# EAGLE design open-bldc-power (EAGLE 6.2)
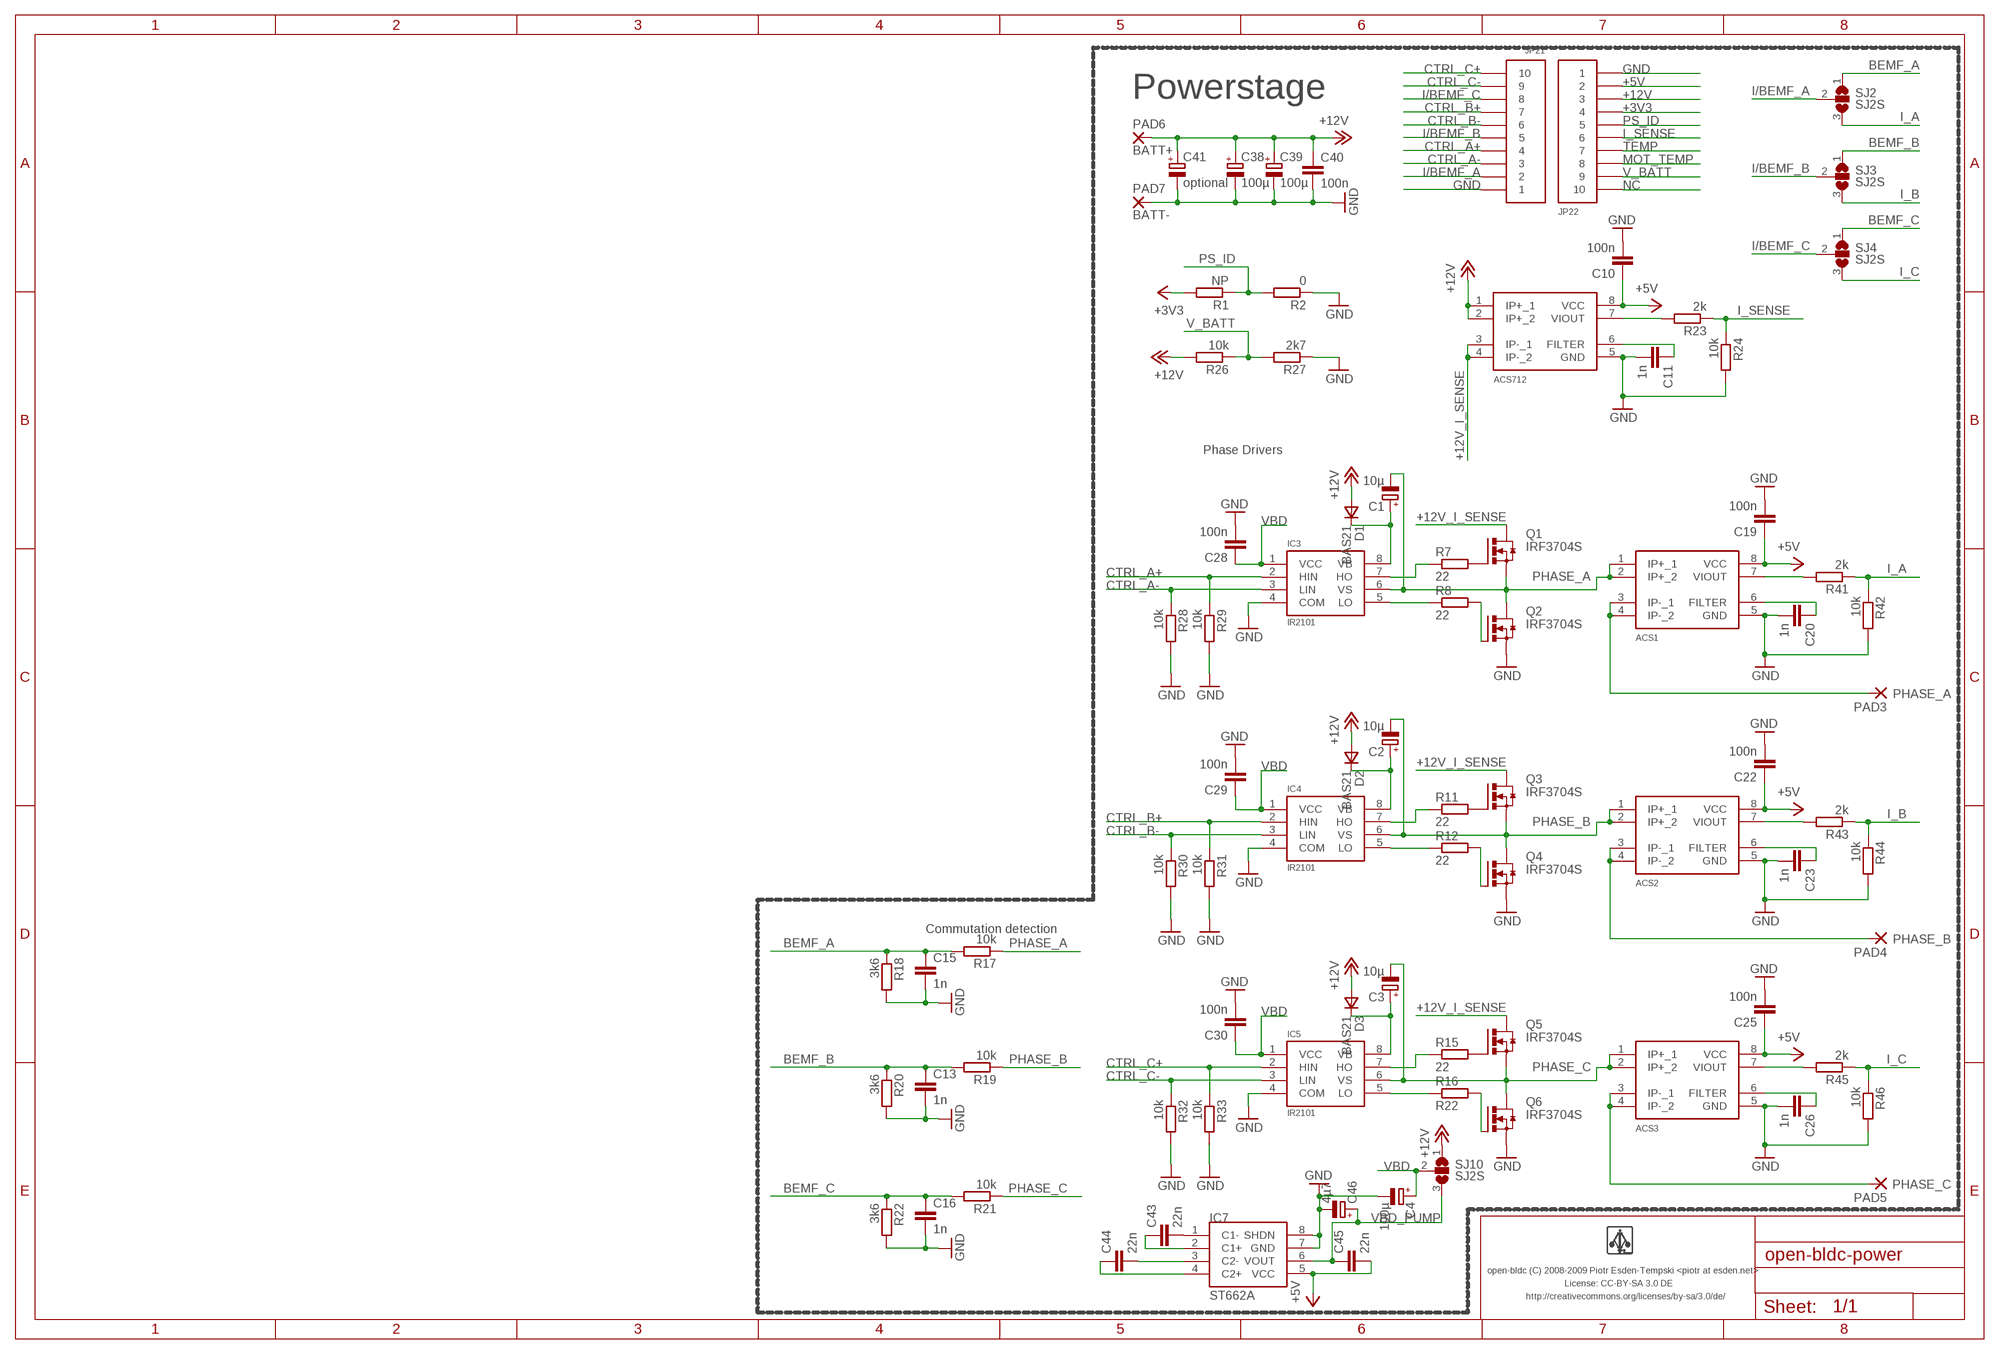
[diagram p0: schematic, sheet 1]

## Parts
ACS1  ACS712  [SO8]
ACS2  ACS712  [SO8]
ACS3  ACS712  [SO8]
ACS712  ACS712  [SO8]
C1  10µ  CPOL-EUA/3216-18R  [A/3216-18R]
C2  10µ  CPOL-EUA/3216-18R  [A/3216-18R]
C3  10µ  CPOL-EUA/3216-18R  [A/3216-18R]
C4  100µ  CPOL-EUD/7343-31R  [D/7343-31R]
C10  100n  C-EUC0603  [C0603]
C11  1n  C-EUC0603  [C0603]
C13  1n  C-EUC0603  [C0603]
C15  1n  C-EUC0603  [C0603]
C16  1n  C-EUC0603  [C0603]
C19  100n  C-EUC0603  [C0603]
C20  1n  C-EUC0603  [C0603]
C22  100n  C-EUC0603  [C0603]
C23  1n  C-EUC0603  [C0603]
C25  100n  C-EUC0603  [C0603]
C26  1n  C-EUC0603  [C0603]
C28  100n  C-EUC0603  [C0603]
C29  100n  C-EUC0603  [C0603]
C30  100n  C-EUC0603  [C0603]
C38  100µ  CPOL-EUD/7343-31R  [D/7343-31R]
C39  100µ  CPOL-EUD/7343-31R  [D/7343-31R]
C40  100n  C-EUC0603  [C0603]
C41  optional  CPOL-EUE5-6  [E5-6]
C43  22n  C-EUC0603  [C0603]
C44  22n  C-EUC0603  [C0603]
C45  22n  C-EUC0603  [C0603]
C46  4µ7  CPOL-EUA/3216-18R  [A/3216-18R]
D1  BAS21  VAR2SOT23  [SOT-23]
D2  BAS21  VAR2SOT23  [SOT-23]
D3  BAS21  VAR2SOT23  [SOT-23]
IC3  IR2101  [SO-8]
IC4  IR2101  [SO-8]
IC5  IR2101  [SO-8]
IC7  ST662A  [SO8]
JP21  PIN_HDR_1.27MM_10  PIN_HDR_1.27MM_10_TH  [PIN_HDR_1.27MM_10]
JP22  PIN_HDR_1.27MM_10  PIN_HDR_1.27MM_10_TH  [PIN_HDR_1.27MM_10]
PAD3  PHASE_A  SMD5  [SMD2,54-5,08]
PAD4  PHASE_B  SMD5  [SMD2,54-5,08]
PAD5  PHASE_C  SMD5  [SMD2,54-5,08]
PAD6  BATT+  SMD5  [SMD2,54-5,08]
PAD7  BATT-  SMD5  [SMD2,54-5,08]
Q1  IRF3704S  [D2PACK]
Q2  IRF3704S  [D2PACK]
Q3  IRF3704S  [D2PACK]
Q4  IRF3704S  [D2PACK]
Q5  IRF3704S  [D2PACK]
Q6  IRF3704S  [D2PACK]
R1  NP  R-EU_R0603  [R0603]
R2  0  R-EU_R0603  [R0603]
R7  22  R-EU_R0603  [R0603]
R8  22  R-EU_R0603  [R0603]
R11  22  R-EU_R0603  [R0603]
R12  22  R-EU_R0603  [R0603]
R15  22  R-EU_R0603  [R0603]
R16  R22  R-EU_R0603  [R0603]
R17  10k  R-EU_R0603  [R0603]
R18  3k6  R-EU_R0603  [R0603]
R19  10k  R-EU_R0603  [R0603]
R20  3k6  R-EU_R0603  [R0603]
R21  10k  R-EU_R0603  [R0603]
R22  3k6  R-EU_R0603  [R0603]
R23  2k  R-EU_R0603  [R0603]
R24  10k  R-EU_R0603  [R0603]
R26  10k  R-EU_R0603  [R0603]
R27  2k7  R-EU_R0603  [R0603]
R28  10k  R-EU_R0603  [R0603]
R29  10k  R-EU_R0603  [R0603]
R30  10k  R-EU_R0603  [R0603]
R31  10k  R-EU_R0603  [R0603]
R32  10k  R-EU_R0603  [R0603]
R33  10k  R-EU_R0603  [R0603]
R41  2k  R-EU_R0603  [R0603]
R42  10k  R-EU_R0603  [R0603]
R43  2k  R-EU_R0603  [R0603]
R44  10k  R-EU_R0603  [R0603]
R45  2k  R-EU_R0603  [R0603]
R46  10k  R-EU_R0603  [R0603]
SJ2  SJ2S  [SJ2S]
SJ3  SJ2S  [SJ2S]
SJ4  SJ2S  [SJ2S]
SJ10  SJ2S  [SJ2S]

## Nets
+3V3: JP22.P$4 R1.2
+5V: ACS1.8(VCC) ACS2.8(VCC) ACS3.8(VCC) ACS712.8(VCC) C10.1 C19.1 C22.1 C25.1 C45.2 IC7.5(VCC) JP22.P$2
+12V: ACS712.1(IP+_1) ACS712.2(IP+_2) C38.+ C39.+ C40.1 C41.+ D1.3(A) D2.3(A) D3.3(A) JP22.P$3 PAD6.1(P) R26.2 SJ10.1
+12V_I_SENSE: ACS712.3(IP-_1) ACS712.4(IP-_2) Q1.2(D) Q3.2(D) Q5.2(D)
BEMF_A: C15.1 R17.2 R18.1 SJ2.1
BEMF_B: C13.1 R19.2 R20.1 SJ3.1
BEMF_C: C16.1 R21.2 R22.1 SJ4.1
CTRL_A+: IC3.2(HIN) JP21.P$4 R29.1
CTRL_A-: IC3.3(LIN) JP21.P$3 R28.1
CTRL_B+: IC4.2(HIN) JP21.P$7 R31.1
CTRL_B-: IC4.3(LIN) JP21.P$6 R30.1
CTRL_C+: IC5.2(HIN) JP21.P$10 R33.1
CTRL_C-: IC5.3(LIN) JP21.P$9 R32.1
GND: ACS1.5(GND) ACS2.5(GND) ACS3.5(GND) ACS712.5(GND) C4.- C10.2 C11.2 C13.2 C15.2 C16.2 C19.2 C20.2 C22.2 C23.2 C25.2 C26.2 C28.2 C29.2 C30.2 C38.- C39.- C40.2 C41.- C46.- IC3.4(COM) IC4.4(COM) IC5.4(COM) IC7.7(GND) IC7.8(SHDN) JP21.P$1 JP22.P$1 PAD7.1(P) Q2.3(S) Q4.3(S) Q6.3(S) R2.1 R18.2 R20.2 R22.2 R24.2 R27.1 R28.2 R29.2 R30.2 R31.2 R32.2 R33.2 R42.2 R44.2 R46.2
I/BEMF_A: JP21.P$2 SJ2.2
I/BEMF_B: JP21.P$5 SJ3.2
I/BEMF_C: JP21.P$8 SJ4.2
I_A: R41.1 R42.1 SJ2.3
I_B: R43.1 R44.1 SJ3.3
I_C: R45.1 R46.1 SJ4.3
I_PHASE_A: ACS1.3(IP-_1) ACS1.4(IP-_2) PAD3.1(P)
I_PHASE_B: ACS2.3(IP-_1) ACS2.4(IP-_2) PAD4.1(P)
I_PHASE_C: ACS3.3(IP-_1) ACS3.4(IP-_2) PAD5.1(P)
I_SENSE: JP22.P$6 R23.1 R24.1
MOT_TEMP: JP22.P$8
N$1: IC4.7(HO) R11.1
N$2: IC3.7(HO) R7.1
N$6: ACS712.7(VIOUT) R23.2
N$7: IC3.5(LO) R8.1
N$11: Q1.1(G) R7.2
N$12: C1.+ D1.1(C) IC3.8(VB)
N$13: IC4.5(LO) R12.1
N$14: Q3.1(G) R11.2
N$15: Q5.1(G) R15.2
N$16: C2.+ D2.1(C) IC4.8(VB)
N$17: Q6.1(G) R16.2
N$18: IC5.7(HO) R15.1
N$19: IC5.5(LO) R16.1
N$21: C3.+ D3.1(C) IC5.8(VB)
N$23: ACS712.6(FILTER) C11.1
N$24: C43.2 IC7.1(C1-)
N$27: C44.2 IC7.3(C2-)
N$29: C43.1 IC7.2(C1+)
N$30: C44.1 IC7.4(C2+)
N$31: ACS1.6(FILTER) C20.1
N$32: ACS1.7(VIOUT) R41.2
N$34: ACS2.6(FILTER) C23.1
N$35: ACS2.7(VIOUT) R43.2
N$37: ACS3.6(FILTER) C26.1
N$38: ACS3.7(VIOUT) R45.2
N$43: Q2.1(G) R8.2
N$44: Q4.1(G) R12.2
NC: JP22.P$10
PHASE_A: ACS1.1(IP+_1) ACS1.2(IP+_2) C1.- IC3.6(VS) Q1.3(S) Q2.2(D) R17.1
PHASE_B: ACS2.1(IP+_1) ACS2.2(IP+_2) C2.- IC4.6(VS) Q3.3(S) Q4.2(D) R19.1
PHASE_C: ACS3.1(IP+_1) ACS3.2(IP+_2) C3.- IC5.6(VS) Q5.3(S) Q6.2(D) R21.1
PS_ID: JP22.P$5 R1.1 R2.2
TEMP: JP22.P$7
V_BATT: JP22.P$9 R26.1 R27.2
VBD: C4.+ C28.1 C29.1 C30.1 IC3.1(VCC) IC4.1(VCC) IC5.1(VCC) SJ10.2
VBD_PUMP: C45.1 C46.+ IC7.6(VOUT) SJ10.3

## Notes on the sheet
- Powerstage
- Phase Drivers
- Commutation detection
- open-bldc (C) 2008-2009 Piotr Esden-Tempski <piotr at esden.net>
- License: CC-BY-SA 3.0 DE
- http://creativecommons.org/licenses/by-sa/3.0/de/

## Library data of the parts
ACS1-ACS3 ACS712 = open-bldc:ACS712
C1-C4 C38 C39 C41 C46 = rcl:CPOL-EU: POLARIZED CAPACITOR, European symbol
C10 C11 C13 C15 C16 C19 C20 C22 C23 C25 C26 C28-C30 C40 C43-C45 = rcl:C-EU: CAPACITOR, European symbol
D1-D3 = zetex:VAR2SOT23: DIODE
IC3-IC5 = open-bldc:IR2101
IC7 = open-bldc:ST662A
JP21 JP22 = open-bldc:PIN_HDR_1.27MM_10
PAD3-PAD7 = wirepad:SMD5: SMD PAD
Q1-Q6 = my-transistor-power:IRF3704: SMPS MOSFET HEXFET® Power MOSFET Source: http://www.irf.com/product-info/datasheets/data/irf3704.pdf
R1 R2 R7 R8 R11 R12 R15-R24 R26-R33 R41-R46 = rcl:R-EU_: RESISTOR, European symbol
SJ2-SJ4 SJ10 = open-bldc:SJ2S

## Net classes
0 default: width 0.152 mm, drill 0.305 mm, clearance 0.152 mm

## Board
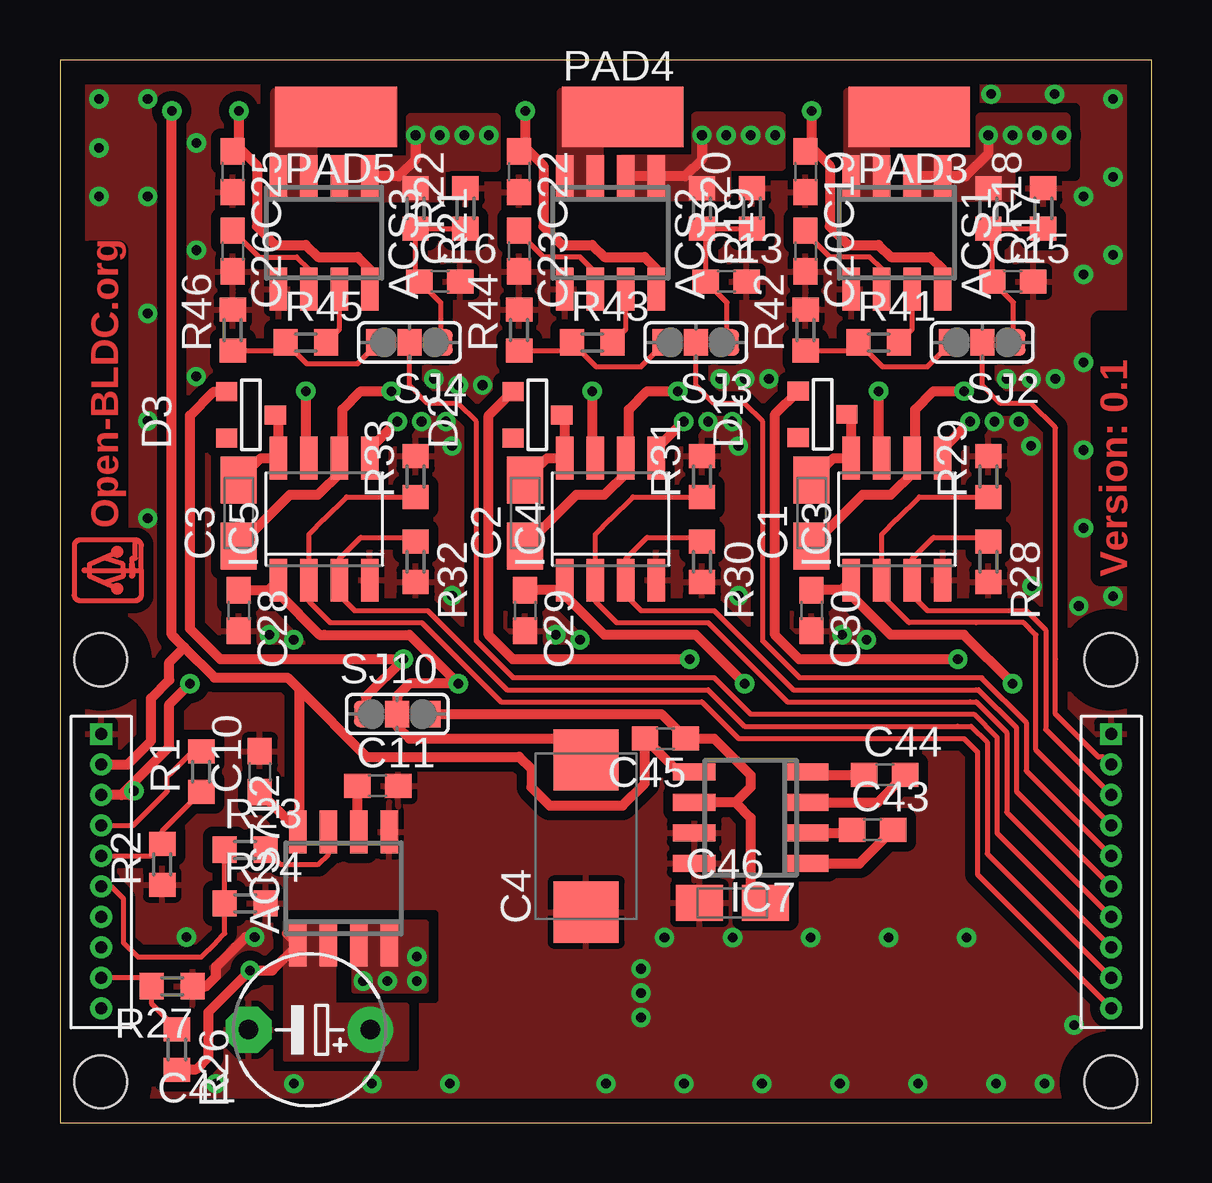
[diagram p1: board, top side]
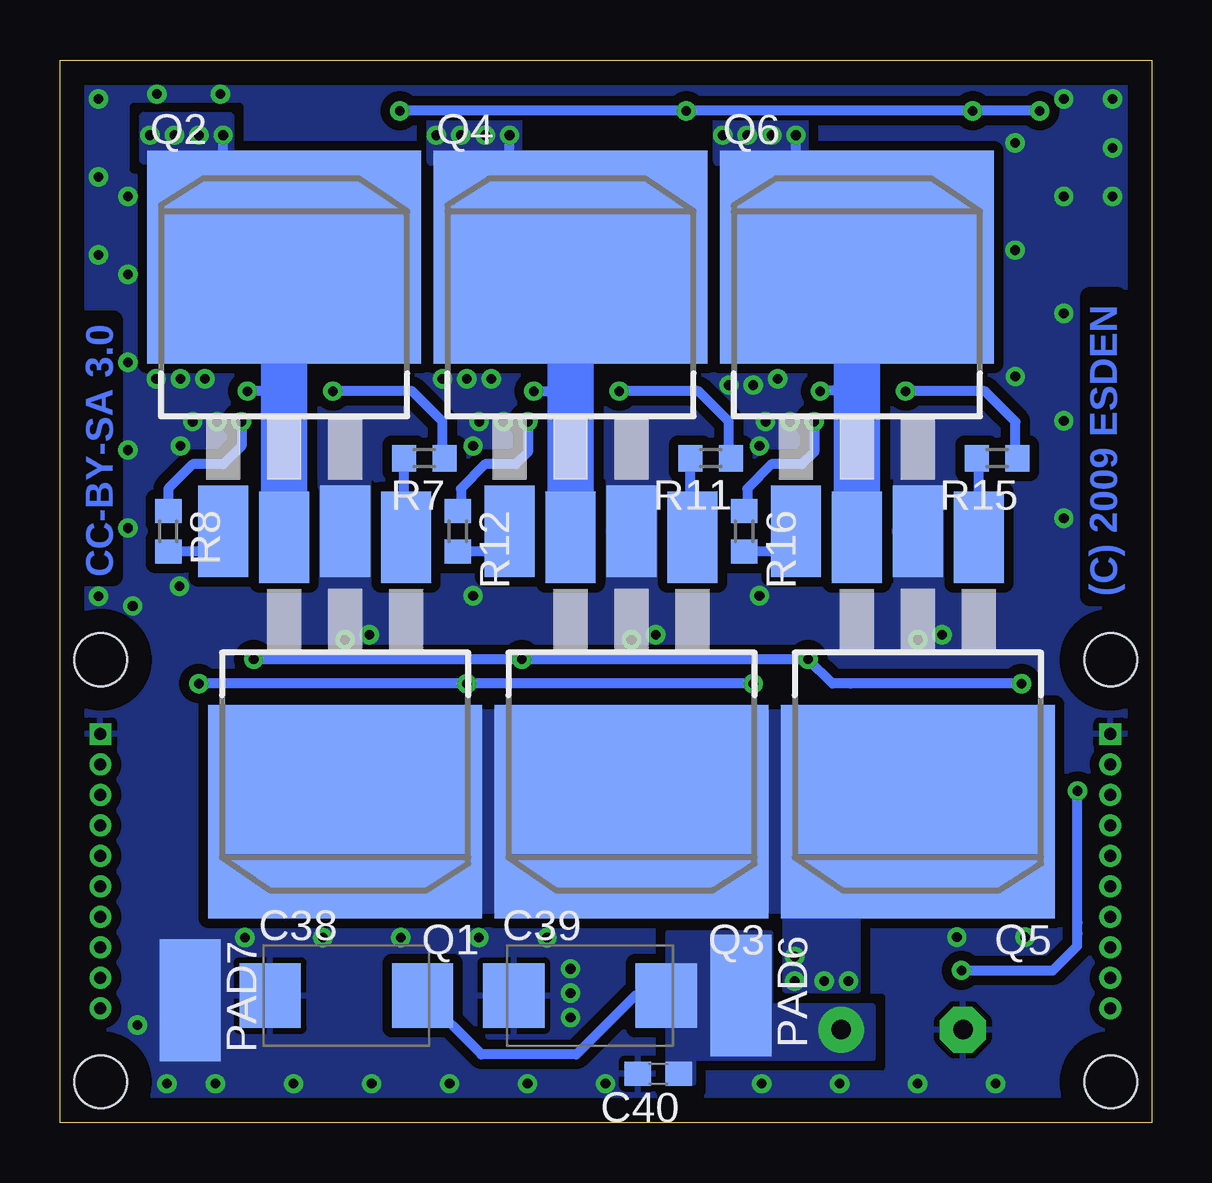
[diagram p2: board, bottom side, seen from below]

Size 45.5 x 44.3 mm. Coordinates in mm from the lower left corner, seen from the top.
Outline: 45.5,0 45.5,44.3 0,44.3 0,0 45.5,0
Copper layers (1*16): Top 0.035mm / dielectric 1.5mm / Bottom 0.035mm
Design rules: minimum track width 8mil, minimum drill 0.4mm, track to track 8mil, track to pad 8mil, pad to pad 8mil, via to via 8mil, smd to smd 8mil, copper to edge 40mil, drill to drill 8mil, minimum pad ring 8mil, minimum via ring 8mil, stop-mask expansion 4mil, vias tented up to drill 0.4mm, thermal gap 10mil
Holes 2.2 mm at 43.8,1.7 1.7,1.7 1.7,19.3 43.8,19.3

### Footprints (pad centres in the part's own frame; a part is rotated, then mirrored left to right if it is on the bottom)
SO8 = smd 0.72 x 1.78: 1 -1.905,-2.35; 2 -0.635,-2.35; 3 0.635,-2.35; 4 1.905,-2.35; 5 1.905,2.35; 6 0.635,2.35; 7 -0.635,2.35; 8 -1.905,2.35
A/3216-18R = smd 1.95 x 1.5: + 1.375,0; - -1.375,0
D/7343-31R = smd 2.55 x 2.7: + 3.175,0; - -3.175,0
C0603 = smd 1.1 x 1: 1 -0.85,0; 2 0.85,0
E5-6 = drill 0.813 pad 1.905: + -2.54,0 | drill 0.813 pad 1.905 octagon: - 2.54,0
SOT-23 = smd 0.787 x 0.889: 1 0.025,-1.016; 2 -0.94,1.016; 3 0.991,1.016
SO-8 = smd 0.72 x 1.78: 1 -1.905,-2.543; 2 -0.635,-2.543; 3 0.635,-2.543; 4 1.905,-2.543; 5 1.905,2.543; 6 0.635,2.543; 7 -0.635,2.543; 8 -1.905,2.543
PIN_HDR_1.27MM_10 = drill 0.5 square: P$1 0,0 | drill 0.5: P$2 0,1.27; P$3 0,2.54; P$4 0,3.81; P$5 0,5.08; P$6 0,6.35; P$7 0,7.62; P$8 0,8.89; P$9 0,10.16; P$10 0,11.43
SMD2,54-5,08 = smd 2.54 x 5.08: 1 0,0
D2PACK = smd 2.083 x 3.81: 1 -2.54,-8.89; 3 2.54,-8.89 | smd 11.43 x 8.89: 2 0,2.54
R0603 = smd 1 x 1.1: 1 -0.85,0; 2 0.85,0
SJ2S = smd 1 x 1.1: 1 -1.3,0; 2 0,0; 3 1.3,0

### Placement (x,y rotation side)
ACS1  34.89,37.1 180 top
ACS2  22.95,37.1 180 top
ACS3  11.01,37.1 180 top
ACS712  11.82,9.77 0 top
C1  31.33,25.42 90 top
C2  19.39,25.42 90 top
C3  7.45,25.42 90 top
C4  21.93,11.95 90 top
C10  8.33,14.63 90 top
C11  13.25,14.04 0 top
C13  27.77,35.07 0 top
C15  39.71,35.07 0 top
C16  15.84,35.07 0 top
C19  31.08,39.64 270 top
C20  31.08,36.34 270 top
C22  19.14,39.64 270 top
C23  19.14,36.34 270 top
C25  7.2,39.64 270 top
C26  7.2,36.34 270 top
C28  7.45,21.35 270 top
C29  19.39,21.35 270 top
C30  31.33,21.35 270 top
C38  33.57,5.3 0 bottom
C39  23.41,5.3 0 bottom
C40  20.56,2.05 180 bottom
C41  10.4,3.88 180 top
C43  33.87,12.21 0 top
C44  34.38,14.49 0 top
C45  25.23,16.02 180 top
C46  28.03,9.16 0 top
D1  31.79,29.5 90 top
D2  19.9,29.48 90 top
D3  7.96,29.48 90 top
IC3  34.89,25.16 0 top
IC4  22.95,25.16 0 top
IC5  11.01,25.16 0 top
IC7  28.79,12.72 90 top
JP21  43.82,16.2 180 top
JP22  1.72,16.2 180 top
PAD3  35.39,41.93 90 top
PAD4  23.46,41.93 270 top
PAD5  11.52,41.93 90 top
PAD6  17.11,5.3 180 bottom
PAD7  40.07,5.1 180 bottom
Q1  33.62,15.51 180 bottom
Q2  36.16,33.54 0 bottom
Q3  21.68,15.51 180 bottom
Q4  24.22,33.54 0 bottom
Q5  9.74,15.51 180 bottom
Q6  12.28,33.54 0 bottom
R1  5.89,14.63 90 top
R2  4.27,10.77 90 top
R7  30.31,27.7 180 bottom
R8  40.98,24.65 270 bottom
R11  18.38,27.7 180 bottom
R12  28.92,24.65 270 bottom
R15  6.44,27.7 180 bottom
R16  16.98,24.65 270 bottom
R17  38.7,38.12 270 top
R18  40.98,38.12 90 top
R19  26.76,38.12 270 top
R20  28.84,38.12 90 top
R21  14.82,38.12 270 top
R22  16.9,38.12 90 top
R23  7.72,11.38 0 top
R24  7.72,9.14 0 top
R26  4.88,3.05 270 top
R27  4.67,5.69 180 top
R28  38.7,23.38 270 top
R29  38.7,26.94 90 top
R30  26.76,23.38 270 top
R31  26.76,26.94 90 top
R32  14.82,23.38 270 top
R33  14.82,26.94 90 top
R41  34.12,32.53 0 top
R42  31.08,33.04 90 top
R43  22.19,32.53 0 top
R44  19.14,33.04 90 top
R45  10.25,32.53 0 top
R46  7.2,33.04 90 top
SJ2  38.44,32.53 180 top
SJ3  26.5,32.53 180 top
SJ4  14.57,32.53 180 top
SJ10  14.06,17.03 0 top

### Tracks (layer width: path | path; a pad name or v marks a point on that pad's centre or on a via)
+3V3
  Top 0.203: JP22.P$4 3.04,12.39 4.47,13.82 4.47,14.43 4.67,14.63 5.52,15.48 R1.2
+5V  (via drill 0.4)
  Top 0.406: ACS2.8 24.85,35.6 24.37,36.08 22.7,36.08 22.19,36.59 20.92,36.59 20.16,37.35 20.16,39.89 19.56,40.49 19.48,40.49 | ACS1.8 36.79,35.58 36.28,36.08 34.63,36.08 34.12,36.59 32.85,36.59 32.09,37.35 32.09,39.89 31.5,40.49 31.42,40.49 | ACS3.8 12.92,35.58 12.41,36.08 10.76,36.08 10.25,36.59 8.98,36.59 8.22,37.35 8.22,39.89 7.62,40.49 | v4.66,42.18 4.66,20.34 4.79,20.21 5.18,19.81 | 5.18,19.81 6.44,18.56 8.17,18.56 9.49,18.56 9.97,18.07 | 9.97,18.07 12.79,15.26 19.14,15.26 19.65,14.75 19.65,13.98 20.41,13.22 23.46,13.22 24.39,14.15 C45.2 25.78,14.62 IC7.5 | 31.42,40.49 C19.1 31.42,40.49 | 19.48,40.49 C22.1 19.48,40.49 | 19.48,40.49 19.39,40.58 v19.39,42.18 | 31.42,40.49 31.33,40.49 v31.33,42.18 | 7.62,40.49 C25.1 | 7.62,40.49 7.46,40.66 v7.46,42.18 | JP22.P$2 2.81,14.93 3.8,15.92 3.8,17.69 4.56,18.46 4.56,19.19 5.18,19.81 | 9.97,18.07 9.97,12.32 9.99,12.3 9.87,12.17 ACS712.8 9.92,12.19 C10.1
  Bottom 0.406: v31.33,42.18 v19.39,42.18 v7.46,42.18 v4.66,42.18
+12V  (via drill 0.4)
  Top 0.406: D1.3 29.81,29.53 29.81,20.34 30.82,19.32 v37.43,19.32 | v26.25,19.32 18.89,19.32 17.87,20.34 17.87,29.48 18.86,30.47 D2.3 | 6.92,30.47 D3.3 6.41,30.47 5.42,29.48 5.42,20.59 6.69,19.32 v14.31,19.32 12.76,17.77 SJ10.1 | 2.56,13.66 JP22.P$3 | 2.56,13.66 4.56,15.66 4.56,17.44 v5.42,18.3 | 2.56,13.66 2.91,13.66 v3.09,13.83 | 9.46,7.87 ACS712.1 8.85,6.35 v7.92,6.35 6.2,4.62 6.2,2.74 5.69,2.23 4.91,2.23 R26.2
  Bottom 0.406: v37.43,19.32 v26.25,19.32 v14.31,19.32 13.3,18.3 12.54,18.3 v5.42,18.3 | v3.09,13.83 3.09,8.35 3.09,7.89 3.1,7.87 3.1,7.37 4.12,6.35 v7.92,6.35 | C39.+ 21.52,5.3 23.98,2.85 27.94,2.85 C38.+
  pour Top (isolate 0.305, no thermals): 14.47,2.66 14.47,4.89 11.42,4.89 11.42,8.35 9.39,8.35 9.39,2.66
  pour Bottom (isolate 0.305, no thermals): 11.62,4.89 11.62,2.66 19.1,2.64 19.1,1.64 20.15,1.64 20.15,7.94 15.89,7.94 15.89,4.89
+12V_I_SENSE  (via drill 0.4)
  other vias: 12.64,5.91 13.65,5.91 14.87,5.91 14.87,6.92
  pour Bottom (no thermals): 4.41,8.91 38.95,8.91 38.95,17.03 4.41,17.03
  pour Top (isolate 0.305, no thermals): 12.23,8.35 12.23,5.5 15.28,5.5 15.28,8.35
  pour Bottom (isolate 0.305, no thermals): 12.23,9.57 12.23,5.5 15.28,5.5 15.28,9.57
BEMF_A
  Top 0.203: SJ2.1 39.74,34.19 C15.1 38.86,37.1 R17.2 R18.1
BEMF_B
  Top 0.203: SJ3.1 27.8,34.19 C13.1 26.93,37.1 R19.2 R20.1
BEMF_C
  Top 0.203: R22.1 R21.2 14.82,35.23 C16.1 15.87,34.19 SJ4.1
CTRL_A+
  Top 0.203: R29.1 35.81,26.09 34.89,25.16 34.25,24.53 IC3.2 34.25,21.99 35.4,20.84 38.19,20.84 40.17,20.84 40.68,20.34 40.68,15.53 JP21.P$4
CTRL_A-
  Top 0.203: R28.1 38.53,24.4 36.41,24.4 35.52,23.51 IC3.3 35.52,21.99 36.16,21.35 38.7,21.35 40.27,21.35 41.08,20.54 41.08,16.39 JP21.P$3
CTRL_B+
  Top 0.203: R31.1 23.88,26.09 22.95,25.16 22.31,24.53 IC4.2 22.31,21.73 23.2,20.84 27.01,20.84 30.32,17.54 37.94,17.54 38.19,17.54 39.46,16.27 39.46,12.94 JP21.P$7
CTRL_B-
  Top 0.203: R30.1 26.59,24.4 24.47,24.4 23.58,23.51 IC4.3 23.58,21.99 24.22,21.35 27.27,21.35 30.57,18.05 38.19,18.05 38.29,18.05 39.87,16.47 39.87,13.8 JP21.P$6
CTRL_C+
  Top 0.203: R33.1 11.94,26.09 11.01,25.16 10.38,24.53 IC5.2 10.38,21.73 11.27,20.84 15.07,20.84 18.38,17.54 26.76,17.54 28.28,16.02 36.92,16.02 37.68,16.02 38.24,15.46 38.24,10.35 JP21.P$10
CTRL_C-
  Top 0.203: R32.1 14.65,24.4 12.54,24.4 11.65,23.51 IC5.3 11.65,21.99 12.28,21.35 15.33,21.35 18.63,18.05 27.01,18.05 28.54,16.52 37.43,16.52 37.99,16.52 38.65,15.87 38.65,11.21 JP21.P$9
GND  (via drill 0.4)
  Top 0.406: R27.1 6.1,5.69 6.5,6.1 6.5,6.5 7.32,7.32 7.74,7.74 v8.12,7.74
  other vias: 40.53,22.37 28.28,21.96 32.6,20.34 20.66,20.34 16.34,21.96 8.72,20.34 17.61,30.75 16.6,30.75 15.58,31 16.34,28.21 16.09,29.23 15.07,29.23 29.55,31 28.54,31 27.52,31 28.03,29.23 27.01,29.23 28.28,28.21 41.49,31 40.47,31 39.46,31 38.95,29.23 39.97,29.23 40.47,28.21 24.22,4.38 24.22,5.4 24.22,6.42 5.27,7.74 21.68,20.13 33.62,20.13 9.74,20.13 5.68,31.1 5.69,36.37 5.69,40.84 1.63,42.67 3.66,42.67 1.63,38.61 1.63,40.64 3.66,38.61 3.66,33.73 3.66,29.26 3.66,25.2 6.5,1.63 9.75,1.63 13,1.63 16.26,1.63 22.76,1.63 26.01,1.63 29.26,1.63 32.51,1.63 35.76,1.63 39.01,1.63 41.05,1.63 34.54,7.72 37.8,7.72 42.27,4.06 42.47,21.54 43.89,21.95 42.67,24.79 42.67,28.04 42.67,31.7 42.67,35.36 42.67,38.61 43.89,42.67 43.89,39.42 43.89,36.17 31.29,7.72 28.04,7.72 25.2,7.72 38.81,42.88 41.45,42.88
  pour Bottom (isolate 0.406, rank 2): 45.3,0.27 0.09,0.27 0.09,43.86 45.3,43.86
  pour Top (isolate 0.406, rank 2): 45.3,0.27 0.09,0.27 0.09,43.86 45.3,43.86
  pour Bottom (no thermals): 38.61,7.72 41.66,7.72 41.66,2.24 38.61,2.24
  pour Bottom (isolate 0.406, no thermals): 8.74,27.23 10.57,27.23 10.57,21.95 8.74,21.95
  pour Bottom (isolate 0.406, no thermals): 20.73,27.23 22.56,27.23 22.56,21.95 20.73,21.95
  pour Bottom (isolate 0.406, no thermals): 32.72,27.23 34.54,27.23 34.54,21.95 32.72,21.95
I/BEMF_A
  Top 0.203: SJ2.2 38.44,30.75 39.2,29.99 40.48,29.99 41.49,28.97 41.49,19.32 41.49,17.05 41.49,17.03 43.28,15.24 43.48,15.24 43.79,14.93 JP21.P$2
I/BEMF_B
  Top 0.203: 38.24,18.56 38.44,18.56 | 38.24,18.56 30.82,18.56 29.3,20.08 29.3,29.23 28.54,29.99 27.27,29.99 26.5,30.75 SJ3.2 | JP21.P$5 40.27,14.67 40.27,16.68 38.39,18.56 38.24,18.56
I/BEMF_C
  Top 0.203: SJ4.2 14.57,30.75 15.33,29.99 16.6,29.99 17.36,29.23 17.36,20.08 18.89,18.56 27.27,18.56 28.79,17.03 37.68,17.03 38.09,17.03 39.05,16.07 39.05,12.07 JP21.P$8
I_A
  Top 0.203: R42.1 32.93,32.19 R41.1 34.29,31.51 36.16,31.51 37.14,32.5 SJ2.3
I_B
  Top 0.203: R44.1 21,32.19 R43.1 22.35,31.51 24.22,31.51 25.2,32.5 SJ3.3
I_C
  Top 0.203: R46.1 9.06,32.19 R45.1 10.29,31.64 12.41,31.64 13.27,32.5 SJ4.3
I_PHASE_A
  pour Top (no thermals): 32.85,38.62 32.85,42.94 37.68,42.94 37.68,40.91 34.38,40.91 34.38,38.62
I_PHASE_B
  pour Top (no thermals): 20.92,38.62 20.92,42.94 25.74,42.94 25.74,40.91 22.44,40.91 22.44,38.62
I_PHASE_C
  pour Top (no thermals): 8.98,38.62 8.98,42.94 13.8,42.94 13.8,40.91 10.5,40.91 10.5,38.62
I_SENSE
  Top 0.203: JP22.P$6 2.14,9.85 2.64,9.35 2.64,7.52 3.25,6.91 5.89,6.91 6.5,7.52 6.87,7.89 R24.1 R23.1
LOGO
  Top 0.203: 3.39,23.03 3.39,22.01 arc-90 3.14,21.76 0.85,21.76 arc-90 0.6,22.01 0.6,24.04 arc-90 0.85,24.3 3.14,24.3 | 3.39,23.03 3.39,24.04 arc90 3.14,24.3 | 2.38,22.27 1.23,22.77 1.23,23.03 | 1.23,23.03 1.23,23.28 2.38,23.79 | 1.87,22.52 2.63,22.77 2.63,23.03 | 2.63,23.03 2.63,23.28 1.84,23.54 | 3.14,24.3 3.14,23.54 3.01,23.54 3.01,23.28 3.04,23.03 3.01,23.03 | 1.23,23.03 2.63,23.03 | 2.63,23.03 3.01,23.03 | 3.01,23.03 3.39,23.03 | 1.23,23.03 1.05,23.03
  Top 0.254: 3.01,23.28 3.01,23.03 3.01,22.8 | 1.05,23.03 1.03,23.03
  Top 0.508: 2.38,23.79 2.4,23.79 | 2.38,22.27 2.4,22.27
N$1  (via drill 0.4)
  Top 0.406: IC4.7 22.19,27.83 v22.19,30.5
  Bottom 0.406: v22.19,30.5 18.89,30.5 17.61,29.23 17.61,27.79 R11.1
N$2  (via drill 0.4)
  Top 0.406: IC3.7 34.12,27.83 v34.12,30.5
  Bottom 0.406: v34.12,30.5 30.82,30.5 29.55,29.23 29.55,27.79 R7.1
N$6
  Top 0.203: 11.38,12.31 ACS712.7 11.19,11.19 10.77,10.77 9.18,10.77 R23.2
N$7  (via drill 0.4)
  Top 0.406: IC3.5 36.79,28.08 v37.94,29.23
  Bottom 0.406: v37.94,29.23 37.94,28.21 38.7,27.45 39.97,27.45 40.98,26.43 R8.1
N$11
  Bottom 0.406: R7.2 31.16,24.49 Q1.1
N$12
  Top 0.406: D1.1 32.98,29.35 IC3.8 32.24,27.7 C1.+
N$13  (via drill 0.4)
  Top 0.406: IC4.5 24.85,28.08 v26,29.23
  Bottom 0.406: v26,29.23 26,27.95 26.5,27.45 27.77,27.45 28.79,26.43 28.79,25.63 R12.1
N$14
  Bottom 0.406: R11.2 19.23,24.49 Q3.1
N$15
  Bottom 0.406: Q5.1 7.2,27.61 R15.2
N$16
  Top 0.406: C2.+ 20.31,27.7 IC4.8 21.04,29.38 D2.1
N$17
  Bottom 0.406: R16.2 15.67,23.8 Q6.1
N$18  (via drill 0.4)
  Top 0.406: IC5.7 10.25,27.83 v10.25,30.5
  Bottom 0.406: v10.25,30.5 6.95,30.5 5.68,29.23 5.68,27.79 R15.1
N$19  (via drill 0.4)
  Top 0.406: IC5.5 12.92,28.08 v14.06,29.23
  Bottom 0.406: v14.06,29.23 14.06,27.95 14.57,27.45 15.84,27.45 16.85,26.43 16.85,25.63 R16.1
N$21
  Top 0.406: D3.1 9.11,29.38 IC5.8 8.37,27.7 C3.+
N$23
  Top 0.406: C11.1 12.4,12.18 ACS712.6
N$24
  Top 0.406: C43.2 33.32,10.81 IC7.1
N$27
  Top 0.406: C44.2 34.09,13.35 IC7.3
N$29
  Top 0.406: C43.1 32.89,12.08 IC7.2
N$30
  Top 0.406: C44.1 31.27,14.49 IC7.4
N$31
  Top 0.203: C20.1 31.08,37.1 32.09,36.08 33.74,36.08 34.25,35.58 ACS1.6
N$32
  Top 0.203: R41.2 35.52,33.07 ACS1.7
N$34
  Top 0.203: C23.1 19.14,37.1 20.16,36.08 21.68,36.08 22.19,35.58 22.19,34.88 ACS2.6
N$35
  Top 0.203: R43.2 23.58,33.07 ACS2.7
N$37
  Top 0.203: C26.1 8.3,36.08 9.87,36.08 10.38,35.58 ACS3.6
N$38
  Top 0.203: ACS3.7 11.65,33.07 R45.2
N$43
  Bottom 0.406: R8.2 39.55,23.8 Q2.1
N$44
  Bottom 0.406: R12.2 27.61,23.8 Q4.1
PHASE_A  (via drill 0.4)
  Top 0.406: C1.- 33.47,26.18 34.63,26.18 | 34.63,26.18 35.52,27.07 IC3.6 | ACS1.2 37.74,39.45 38.7,40.4 v38.7,41.16 | 34.63,26.18 35.65,27.19 35.65,29.73 36.41,30.5 v37.68,30.5
  Bottom 0.406: v38.7,41.16 38.7,39.89 36.92,38.12 36.16,37.35 Q2.2 | v37.68,30.5 37.66,30.52 36.16,30.52
  Bottom 1.93: Q1.3 36.16,30.52 Q2.2
  other vias: 39.71,41.16 40.73,41.16 41.74,41.16
  pour Top (no thermals): 35.32,38.6 39.64,38.6 39.64,39.87 41.92,39.87 41.92,41.9 38.37,41.9 38.37,40.12 35.32,40.12
  pour Bottom (no thermals): 38.44,41.93 38.44,40.15 42,40.15 42,41.93
PHASE_B  (via drill 0.4)
  Top 0.406: C2.- 21.53,26.18 22.7,26.18 | 22.7,26.18 23.58,27.07 IC4.6 | ACS2.2 26.06,39.45 26.76,40.15 v26.76,41.16 | 22.7,26.18 23.71,27.19 23.71,29.73 24.47,30.5 v25.74,30.5
  Bottom 0.406: v26.76,41.16 26.76,40.4 24.98,38.62 24.22,37.86 Q4.2 | v25.74,30.5 24.22,30.5
  Bottom 1.93: Q3.3 24.22,30.5 Q4.2
  other vias: 27.77,41.16 28.79,41.16 29.81,41.16
  pour Top (no thermals): 23.46,38.62 27.77,38.62 27.77,39.89 30.06,39.89 30.06,41.93 26.5,41.93 26.5,40.15 23.46,40.15
  pour Bottom (no thermals): 26.45,41.85 26.45,40.07 30.01,40.07 30.01,41.85
PHASE_C  (via drill 0.4)
  Top 0.406: C3.- 9.59,26.18 10.76,26.18 | 10.76,26.18 11.65,27.07 IC5.6 | 10.76,26.18 11.77,27.19 11.77,29.73 12.54,30.5 v13.8,30.5 | ACS3.1 14.12,39.45 14.82,40.15 v14.82,41.16
  Bottom 0.406: v13.8,30.5 13.75,30.55 12.28,30.55 | v14.82,41.16 14.82,40.4 13.3,38.88 12.28,37.86 Q6.2
  Bottom 1.93: Q5.3 12.28,30.55 Q6.2
  other vias: 15.84,41.16 16.85,41.16 17.87,41.16
  pour Top (no thermals): 11.57,38.57 15.89,38.57 15.89,39.84 18.17,39.84 18.17,41.87 14.62,41.87 14.62,40.1 11.57,40.1
  pour Bottom (no thermals): 14.52,41.85 14.52,40.07 18.07,40.07 18.07,41.85
PS_ID
  Top 0.203: R1.1 4.27,12.15 R2.2 3.77,11.12 JP22.P$5
V_BATT
  Top 0.203: R26.1 3.82,4.95 R27.2 3.47,6.04 JP22.P$9
VBD  (via drill 0.4)
  Top 0.406: C29.1 20.63,22.2 arc90 IC4.1 21.04,21.99 22.7,20.34 26.5,20.34 v28.54,18.3 | C28.1 8.69,22.2 IC5.1 9.11,22.06 10.83,20.34 11.01,20.34 14.57,20.34 v16.6,18.3 14.57,18.3 14.06,17.8 SJ10.2 14.06,16.52 14.57,16.02 21.04,16.02 C4.+ | C30.1 32.56,22.2 IC3.1 32.98,21.99 34.63,20.34 37.68,20.34 v39.71,18.3
  Bottom 0.406: v39.71,18.3 v28.54,18.3 v16.6,18.3
VBD_PUMP
  Top 0.406: C46.+ 28.79,9.77 28.79,12.71 28.16,13.35 | 28.16,13.35 IC7.6 28.16,13.35 | 28.16,13.35 28.79,13.98 28.79,14.49 27.27,16.02 C45.1 25.07,17.03 24.05,17.03 16.6,17.03 SJ10.3

### Text on the board
Top: Open-BLDC.org | Version: 0.1
Bottom: CC-BY-SA 3.0 | (C) 2009 ESDEN
tStop: Open-BLDC.org | Version: 0.1
bStop: CC-BY-SA 3.0 | (C) 2009 ESDEN